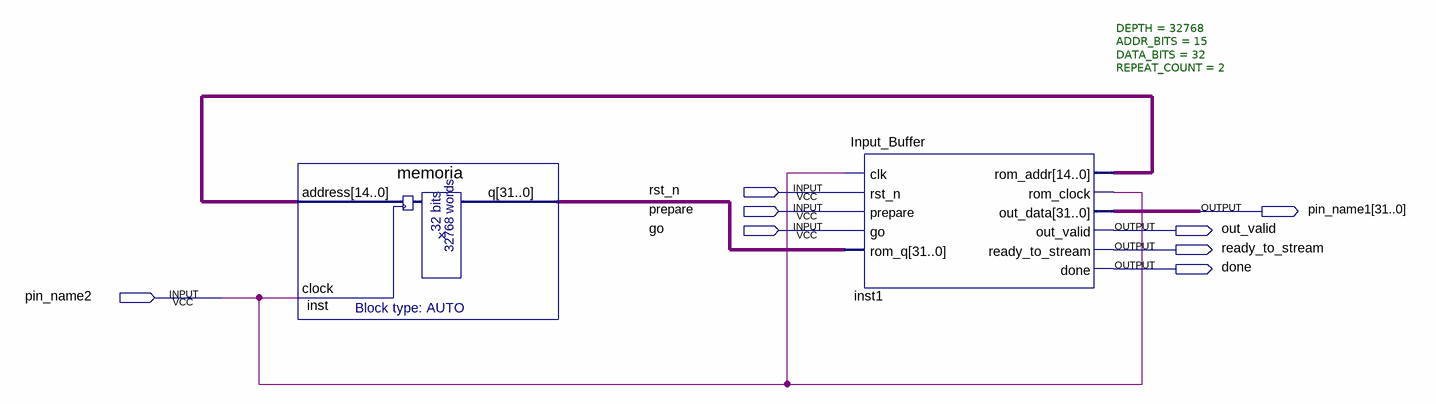
[diagram p0: schematic sheet]
// Quartus schematic TOP.bdf as structural Verilog: 2 symbols, 8 pins
module TOP (
  input  rst_n,
  input  prepare,
  input  go,
  input  pin_name2,
  output [31:0] pin_name1,
  output out_valid,
  output ready_to_stream,
  output done
);

  wire [14:0] inst1_rom_addr;
  wire [31:0] inst_q;

  memoria inst (.address(inst1_rom_addr), .clock(pin_name2), .q(inst_q));
  Input_Buffer #(.DEPTH(32768), .ADDR_BITS(15), .DATA_BITS(32), .REPEAT_COUNT(2)) inst1 (
    .clk(pin_name2), .rst_n(rst_n), .prepare(prepare), .go(go), .rom_q(inst_q), .rom_addr(inst1_rom_addr),
    .rom_clock(pin_name2), .out_data(pin_name1), .out_valid(out_valid), .ready_to_stream(ready_to_stream),
    .done(done));
endmodule
